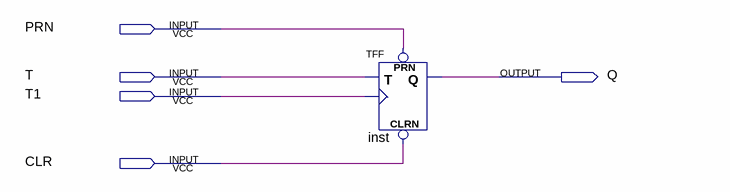
[diagram p0: schematic sheet]
// Quartus schematic T-flipflopDiagram.bdf as structural Verilog: 1 symbols, 5 pins
module \T-flipflopDiagram  (
  input  PRN,
  input  T,
  input  T1,
  input  CLR,
  output Q
);

  TFF inst (.PRN(PRN), .CLRN(CLR), .T(T), .CLK(T1), .Q(Q));
endmodule
